# Altium schematic sheet LM2596.SchDoc
size A4
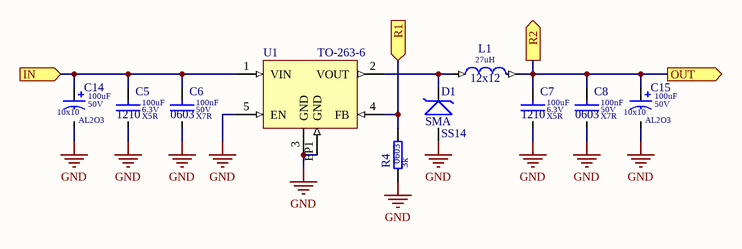
[diagram p0: LM2596.SchDoc]

## Parts
C5  value 100uF  Dielectric: X5R  Voltage: 6.3V  SCH_Footprint: 1210  [C_1210_3225]  (hidden comment: Ceramic X5R)
C6  value 100nF  Dielectric: X7R  Voltage: 50V  SCH_Footprint: 0603  [C_0603_1608]  (hidden comment: Ceramic X7R)
C7  value 100uF  Dielectric: X5R  Voltage: 6.3V  SCH_Footprint: 1210  [C_1210_3225]  (hidden comment: Ceramic X5R)
C8  value 100nF  Dielectric: X7R  Voltage: 50V  SCH_Footprint: 0603  [C_0603_1608]  (hidden comment: Ceramic X7R)
C14  value 100uF  Dielectric: AL2O3  SCH_Footprint: 10x10  Voltage: 50V  [CE_D_10x10MM]  (hidden comment: Electrolytic Capacitor)
C15  value 100uF  Dielectric: AL2O3  SCH_Footprint: 10x10  Voltage: 50V  [CE_D_10x10MM]  (hidden comment: Electrolytic Capacitor)
D1  SCH_Footprint: SMA  [SMA_DO-214AC]  (hidden comment: SS14)
L1  value 27uH  SCH_Footprint: 12x12  [L_SRR1280-XXXY]  (hidden comment: Inductor)
R4  value 3k  SCH_Footprint: 0603  [R_NC_0603_1608]  (hidden comment: Resistor)
U1  VR_LM2596  [TO-263-6]  (value not drawn)

## Ports
IN (in), OUT (out), R1 (in), R2 (out)

## Nets
GND: C5.2 C6.2 C7.2 C8.2 C14.2 C15.2 D1.2 R4.1 U1.3(GND) U1.5(EN) U1.EP1(GND)
IN: C5.1 C6.1 C14.1 U1.1(VIN) ; port IN
OUT: C7.1 C8.1 C15.1 L1.2 ; port R2, port OUT
R1: R4.2 U1.4(FB) ; port R1
NetD1_1: D1.1 L1.1 U1.2(VOUT)

## Library data of the parts
C5 C7 = C_100uF_6.3V_X5R_1210_20: Capacitor; Manufacturer: TDK; Manufacturer Part Number: C3225X5R0J107M250AC; Tolerance (%): 20; Part Number: C_100uF_6.3V_X5R_1210_20; HelpURL: https://datasheet.octopart.com/C3225X5R0J107M250AC-TDK-datasheet-41194876.pdf; Supplier 1: TME; Supplier 2: RS Components; Supplier Part Number 2: 7407685P; Supplier 3: Farnell; Supplier Part Number 3: 2522162; Supplier 4: Mouser; Supplier Part Number 4: 810-C3225X5R0J107M; Supplier 5: Digi-Key; Supplier Part Number 5: 445-1437-1-ND
C6 C8 = C_100nF_50V_X7R_0603_5: Capacitor; Manufacturer: Samsung; Manufacturer Part Number: CL10B104JB8NNNC; Tolerance (%): 5; Part Number: C_100nF_50V_X7R_0603_5; HelpURL: http://www.tme.eu/pl/Document/4a42202b32dab16128fe107dd69598cc/samsung-chip-cap.pdf; Supplier 1: TME; Supplier Part Number 1: CL10B104JB8NNNC; Supplier 2: RS Components; Supplier 3: Farnell; Supplier 4: Mouser; Supplier 5: Digi-Key
C14 C15 = CE_100uF_50V_AL2O3_10x10_20: Polarized Capacitor; Manufacturer: Nichicon; Manufacturer Part Number: UUX1H101MNL1GS; Tolerance (%): 20; Part Number: CE_100uF_50V_AL2O3_10x10_20; HelpURL: https://datasheet.octopart.com/UUX1H101MNL1GS-Nichicon-datasheet-62047998.pdf; Supplier 1: TME; Supplier Part Number 1: UUX1H101MNL1GS; Supplier 2: RS Components; Supplier Part Number 2: 739-3107; Supplier 3: Farnell; Supplier Part Number 3: 2841943; Supplier 4: Mouser; Supplier Part Number 4: 647-UUX1H101MNL1GS; Supplier 5: Digi-Key; Supplier Part Number 5: 493-6269-1-ND; Supplier 6: LCSC
D1 = DS_SS14_1A_40V_SMA: Manufacturer: Fairchild Semiconductor; Voltage: 40V; Current: 1A; Value: SS14; Part Number: DS_SS14_1A_40V_SMA; HelpURL: https://www.vishay.com/docs/88746/ss12.pdf; Manufacturer Part Number: SS14; Supplier 1: TME; Supplier 2: RS Components; Supplier 3: Farnell; Supplier 4: Mouser; Supplier Part Number 4: 512-SS14; Supplier 5: Digi-Key; Supplier Part Number 5: SS14CT
L1 = L_27uH_3.9A_SRR1280: Induction; Manufacturer: Bourns; Manufacturer Part Number: SRR1280-270M; Current: 3.9A; Resistance: 52mR; Part Number: L_27uH_3.9A_SRR1280; HelpURL: https://www.bourns.com/pdfs/SRR1280.pdf; Supplier 1: TME; Supplier 2: RS Components; Supplier Part Number 2: 8749766P; Supplier 3: Farnell; Supplier Part Number 3: 2333859; Supplier 4: Mouser; Supplier Part Number 4: 652-SRR1280-270M; Supplier 5: Digi-Key
R4 = R_GENERIC_0603: Part Number: R_GENERIC_0603; Supplier 1: TME; Supplier 2: RS Components; Supplier 3: Farnell; Supplier 4: Mouser; Supplier 5: Digi-Key
U1 = VR_LM2596-ADJ: SCH_Footprint: TO-263-6; Part Number: VR_LM2596-ADJ; Supplier 1: TME; Supplier 2: RS Components; Supplier 3: Farnell; Supplier 4: Mouser; Supplier 5: Digi-Key